# EAGLE design f103Ard (EAGLE 4.13)
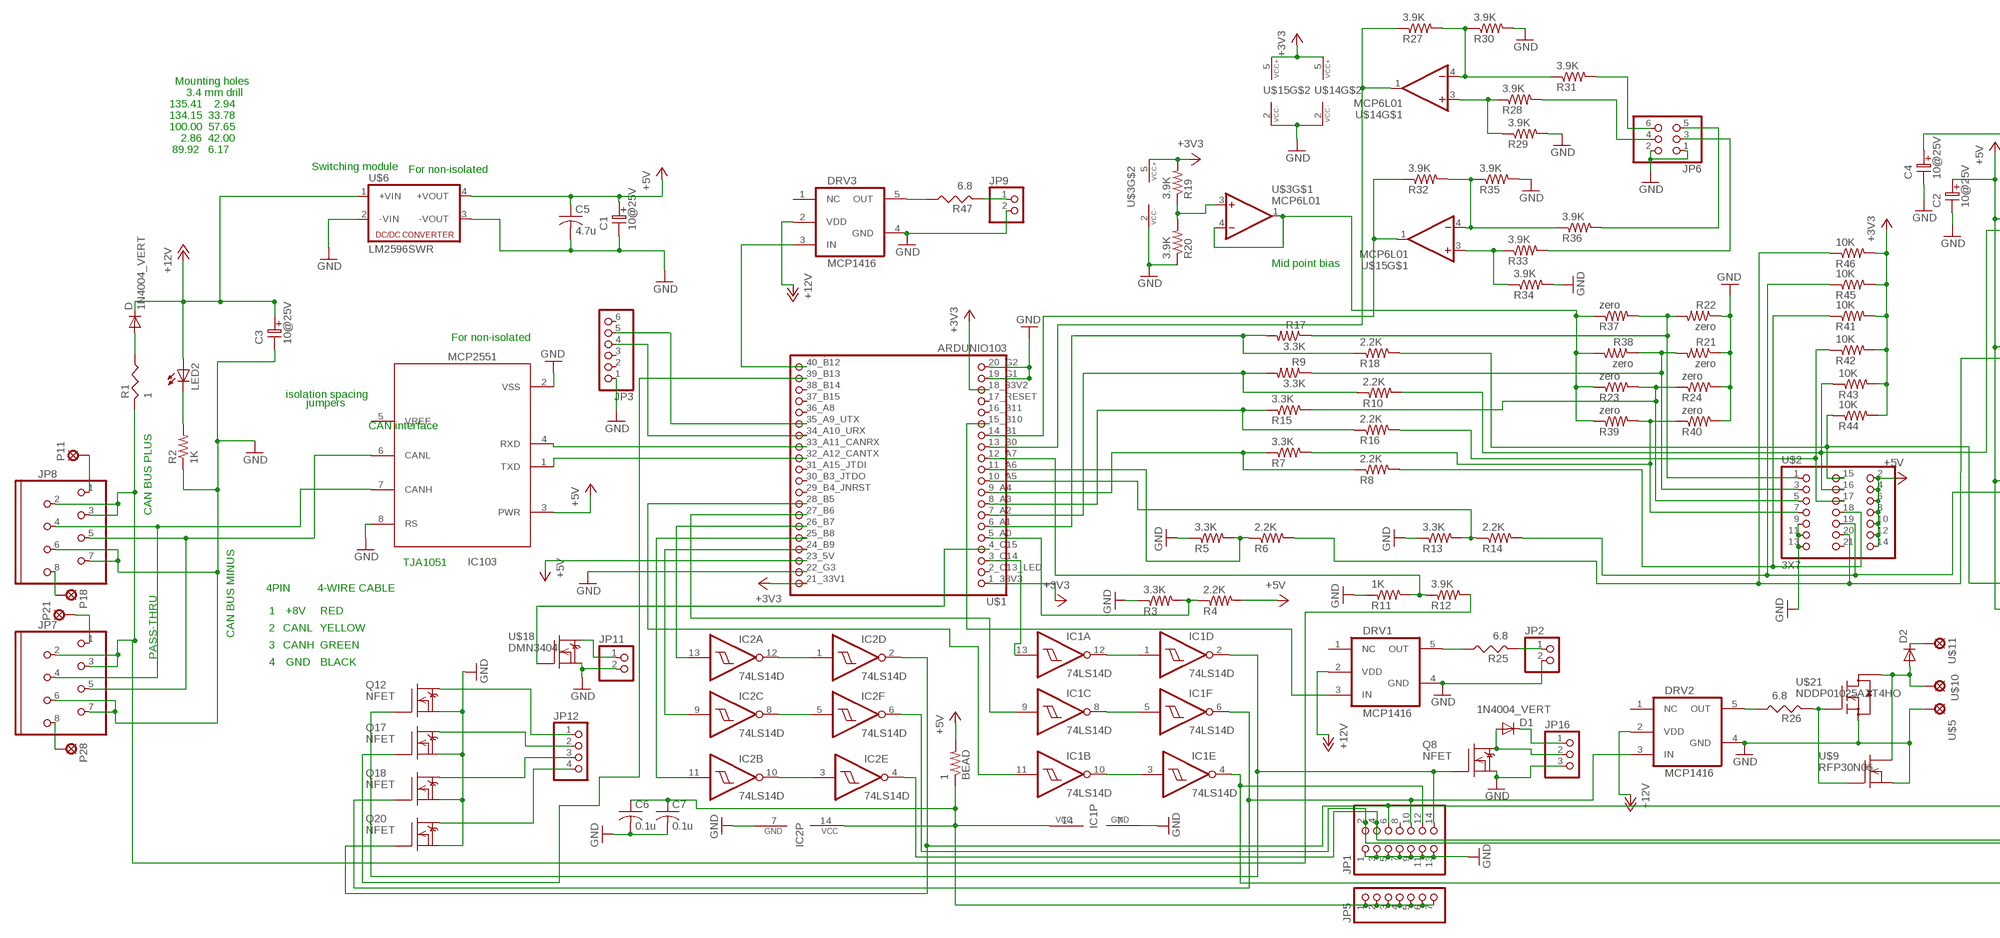
[diagram p0: schematic, sheet 1, part 1 of 2]
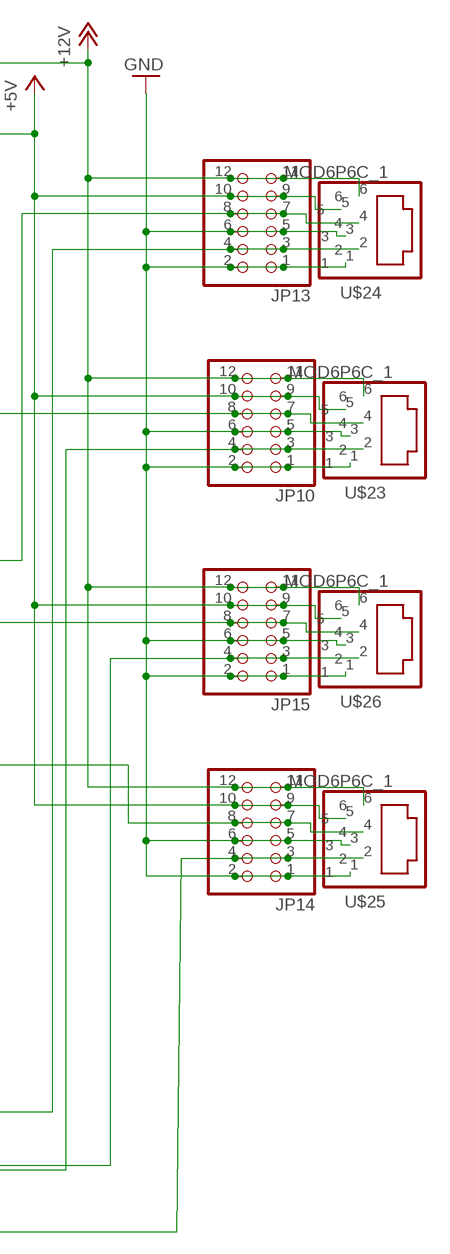
[diagram p1: schematic, sheet 1, part 2 of 2]

## Parts
BEAD  1  R-US_R0603  [R0603]
C1  10@25V  ELC-2,5L  [ES-2,5L]
C2  10@25V  ELC-2,5L  [ES-2,5L]
C3  10@25V  ELC-2,5L  [ES-2,5L]
C4  10@25V  ELC-2,5L  [ES-2,5L]
C5  4.7u  C-USC0603  [C0603]
C6  0.1u  C-USC0603  [C0603]
C7  0.1u  C-USC0603  [C0603]
D  1N4004_VERT  [DO41-10_VERT]
D1  1N4004_VERT  [DO41-10_VERT]
D2  DIODE-DO220S  [DO220S]
DRV1  MCP1416  [SOT23-5]
DRV2  MCP1416  [SOT23-5]
DRV3  MCP1416  [SOT23-5]
IC1  74LS14D  [SO14]
IC2  74LS14D  [SO14]
IC103  MCP2551  [SO-08]
JP1  PINHD-2X7  [2X07]
JP2  PINHD-1X2  [1X02]
JP3  PINHD-1X6  [1X06]
JP5  PINHD-1X7  [1X07]
JP6  PINHD-2X3  [2X03]
JP7  MOD8P8C  [MOD8P8C]
JP8  MOD8P8C  [MOD8P8C]
JP9  PINHD-1X2  [1X02]
JP10  PINHD-2X6  [2X06]
JP11  PINHD-1X2  [1X02]
JP12  PINHD-1X4  [1X04]
JP13  PINHD-2X6  [2X06]
JP14  PINHD-2X6  [2X06]
JP15  PINHD-2X6  [2X06]
JP16  PINHD-1X3  [1X03]
LED2  LEDCHIPLED_0805  [CHIPLED_0805]
P11  SOLPAD035  [SOLDPAD035]
P18  SOLPAD035  [SOLDPAD035]
P21  SOLPAD035  [SOLDPAD035]
P28  SOLPAD035  [SOLDPAD035]
Q8  NFET  DMN3404L  [SOT-23]
Q12  NFET  DMN3404L  [SOT-23]
Q17  NFET  DMN3404L  [SOT-23]
Q18  NFET  DMN3404L  [SOT-23]
Q20  NFET  DMN3404L  [SOT-23]
R1  1  RESUS-S2,5  [RS-2,5]
R2  1K  R-US_R0603  [R0603]
R3  3.3K  R-US_R0603  [R0603]
R4  2.2K  R-US_R0603  [R0603]
R5  3.3K  R-US_R0603  [R0603]
R6  2.2K  R-US_R0603  [R0603]
R7  3.3K  R-US_R0603  [R0603]
R8  2.2K  R-US_R0603  [R0603]
R9  3.3K  R-US_R0603  [R0603]
R10  2.2K  R-US_R0603  [R0603]
R11  1K  R-US_R0603  [R0603]
R12  3.9K  R-US_R0603  [R0603]
R13  3.3K  R-US_R0603  [R0603]
R14  2.2K  R-US_R0603  [R0603]
R15  3.3K  R-US_R0603  [R0603]
R16  2.2K  R-US_R0603  [R0603]
R17  3.3K  R-US_R0603  [R0603]
R18  2.2K  R-US_R0603  [R0603]
R19  3.9K  R-US_R0603  [R0603]
R20  3.9K  R-US_R0603  [R0603]
R21  zero  R-US_R0603  [R0603]
R22  zero  R-US_R0603  [R0603]
R23  zero  R-US_R0603  [R0603]
R24  zero  R-US_R0603  [R0603]
R25  6.8  RESUS-S2,5  [RS-2,5]
R26  6.8  RESUS-S2,5  [RS-2,5]
R27  3.9K  R-US_R0603  [R0603]
R28  3.9K  R-US_R0603  [R0603]
R29  3.9K  R-US_R0603  [R0603]
R30  3.9K  R-US_R0603  [R0603]
R31  3.9K  R-US_R0603  [R0603]
R32  3.9K  R-US_R0603  [R0603]
R33  3.9K  R-US_R0603  [R0603]
R34  3.9K  R-US_R0603  [R0603]
R35  3.9K  R-US_R0603  [R0603]
R36  3.9K  R-US_R0603  [R0603]
R37  zero  R-US_R0603  [R0603]
R38  zero  R-US_R0603  [R0603]
R39  zero  R-US_R0603  [R0603]
R40  zero  R-US_R0603  [R0603]
R41  10K  R-US_R0603  [R0603]
R42  10K  R-US_R0603  [R0603]
R43  10K  R-US_R0603  [R0603]
R44  10K  R-US_R0603  [R0603]
R45  10K  R-US_R0603  [R0603]
R46  10K  R-US_R0603  [R0603]
R47  6.8  RESUS-S2,5  [RS-2,5]
U$1  ARDUNIO103  [ARDUNIO103]
U$2  3X7  [3X7]
U$3  MCP6L01  [SOT23-5]
U$5  SOLPAD060  [SOLPAD060]
U$6  LM2596SWR  [LM2596SW]
U$9  RFP30N06  [TO220V]
U$10  SOLPAD060  [SOLPAD060]
U$11  SOLPAD060  [SOLPAD060]
U$14  MCP6L01  [SOT23-5]
U$15  MCP6L01  [SOT23-5]
U$18  DMN3404L  [SOT-23]
U$21  NDDP01025AZT4HO  [TO-252]
U$23  MOD6P6C_1  [MOD6P6C_1]
U$24  MOD6P6C_1  [MOD6P6C_1]
U$25  MOD6P6C_1  [MOD6P6C_1]
U$26  MOD6P6C_1  [MOD6P6C_1]

## Nets
5VISO: BEAD.1 C6.1 C7.1 IC1.14(P:VCC) IC2.14(P:VCC) JP5.1 JP5.2 JP5.3 JP5.4 JP5.5 JP5.6 JP5.7
+3V3: R19.2 R41.2 R42.2 R43.2 R44.2 R45.2 R46.2 U$1.1_33V3 U$1.18_33V2 U$1.21_33V1 U$3.5(VCC+) U$14.5(VCC+) U$15.5(VCC+)
+5V: BEAD.2 C1.1 C2.1 C5.1 IC103.3(PWR) JP10.9 JP10.10 JP13.9 JP13.10 JP14.9 JP14.10 JP15.9 JP15.10 R4.2 U$1.23_5V U$2.2 U$2.4 U$2.6 U$2.8 U$2.10 U$2.12 U$2.14 U$6.4(+VOUT) U$23.5 U$24.5 U$25.5 U$26.5
+12V: C3.1 C4.1 D.C DRV1.2(VDD) DRV2.2(VDD) DRV3.2(VDD) JP10.11 JP10.12 JP13.11 JP13.12 JP14.11 JP14.12 JP15.11 JP15.12 LED2.A U$6.1(+VIN) U$23.6 U$24.6 U$25.6 U$26.6
+12V_RESISTORED: D.A R1.1
A0: R3.2 R4.1 U$1.5_A0
A1: R17.2 R18.1 U$1.6_A1
A1BIAS: R17.1 R22.2 R37.2 U$2.1
A2: R9.2 R10.1 U$1.7_A2
A2BIAS: R9.1 R21.2 R38.1 U$2.3
A3: R15.1 R16.1 U$1.8_A3
A3BIAS: R15.2 R23.2 R24.1 U$2.5
A4: R7.1 R8.1 U$1.9_A4
A4BIAS: R7.2 R39.2 R40.1 U$2.7
A5: R13.2 R14.1 U$1.10_A5
A6: R5.2 R6.1 U$1.11_A6
A7: R11.2 R12.1 U$1.12_A7
B0: R27.1 U$1.13_B0 U$14.1(OUT)
B0_M-IN: R27.2 R30.1 R31.1 U$14.4(-IN)
B0_M_DIV: JP6.6 R31.2
B0_P_DIV: JP6.4 R28.2
B0_P_IN: R28.1 R29.1 U$14.3(+IN)
B1: R32.1 U$1.14_B1 U$15.1(OUT)
B1_M_DIV: JP6.5 R36.2
B1_M_IN: R32.2 R35.1 R36.1 U$15.4(-IN)
B1_P_DIV: JP6.3 R33.2
B1_P_M: R33.1 R34.1 U$15.3(+IN)
B5: IC1.11(B:I) U$1.28_B5
B5BUF: IC1.4(E:O) JP1.12 JP14.3 JP14.4 U$25.2
B6: IC1.9(C:I) U$1.27_B6
B6BUFF: DRV2.3(IN) IC1.6(F:O) JP1.10 Q18.1(G)
B7: IC2.13(A:I) U$1.26_B7
B7BUF: IC2.2(D:O) JP1.6 JP13.3 JP13.4 Q20.1(G) U$24.2
B8: IC2.11(B:I) U$1.25_B8
B8BUF: IC2.4(E:O) JP1.4 JP15.3 JP15.4 U$26.2
B9: IC2.9(C:I) U$1.24_B9
B9BUF: IC2.6(F:O) JP1.2 JP10.3 JP10.4 U$23.2
B10: DRV1.3(IN) U$1.15_B10
B10DRV: DRV1.5(OUT) R25.1
B10DRVOUT: JP2.1 R25.2
B12: DRV3.3(IN) U$1.40_B12
B12DRV: DRV3.5(OUT) R47.1
B12DRVOUT: JP9.1 R47.2
B13: Q17.1(G) U$1.39_B13
BF6: JP12.3 Q18.3(D)
BF7: JP12.4 Q20.3(D)
BIA_MIDPT_IN: R19.1 R20.2 U$3.3(+IN)
BIAS_MIDPT_OUT: R23.1 R37.1 R38.2 R39.1 U$3.1(OUT) U$3.4(-IN)
C14: IC1.13(A:I) U$1.3_C14
C14BUF: IC1.2(D:O) JP1.14 Q8.1(G) Q12.1(G)
C15: U$1.4_C15 U$18.1(G)
CAN_RAW_PLUS: JP7.2 JP7.3 JP8.2 JP8.3 R1.2 R12.2
CANCABLE_1_1: JP8.1 P11.MP
CANCABLE_1_8: JP8.8 P18.MP
CANCABLE_2_1: JP7.1 P21.MP
CANCABLE_2_8: JP7.8 P28.MP
CANRX: IC103.4(RXD) U$1.33_A11_CANRX
CANTX: IC103.1(TXD) U$1.32_A12_CANTX
CF14: JP12.1 Q12.3(D)
DIODE+: D2.C U$11.MP
DIV1: JP14.7 JP14.8 R18.2 R44.1 U$2.15 U$25.4
DIV2: JP13.7 JP13.8 R10.2 R43.1 U$2.16 U$24.4
DIV3: R16.2 R42.1 U$2.17
DIV4: R8.2 R41.1 U$2.18
DIV5: JP15.7 JP15.8 R14.2 R45.1 U$2.19 U$26.4
DIV6: JP10.7 JP10.8 R6.2 R46.1 U$2.20 U$23.4
FET-D: D2.A U$9.2(D) U$10.MP U$21.3(D)
GND: C1.2 C2.2 C3.2 C4.2 C5.2 C6.2 C7.2 DRV1.4(GND) DRV2.4(GND) DRV3.4(GND) IC1.7(P:GND) IC2.7(P:GND) IC103.2(VSS) IC103.8(RS) JP1.1 JP1.3 JP1.5 JP1.7 JP1.9 JP1.11 JP1.13 JP2.2 JP3.1 JP6.1 JP6.2 JP7.6 JP7.7 JP8.6 JP8.7 JP9.2 JP10.1 JP10.2 JP10.5 JP10.6 JP11.2 JP13.1 JP13.2 JP13.5 JP13.6 JP14.1 JP14.2 JP14.5 JP14.6 JP15.1 JP15.2 JP15.5 JP15.6 JP16.3 Q8.2(S) Q12.2(S) Q17.2(S) Q18.2(S) Q20.2(S) R2.1 R3.1 R5.1 R11.1 R13.1 R20.1 R21.1 R22.1 R24.2 R29.2 R30.2 R34.2 R35.2 R40.2 U$1.19_G1 U$1.20_G2 U$1.22_G3 U$2.9 U$2.11 U$2.13 U$3.2(VCC-) U$5.MP U$6.2(-VIN) U$6.3(-VOUT) U$9.3(S) U$14.2(VCC-) U$15.2(VCC-) U$18.2(S) U$21.2(S) U$23.1 U$23.3 U$24.1 U$24.3 U$25.1 U$25.3 U$26.1 U$26.3
LED_BUS_PWR: LED2.C R2.2
MCP2551_CANH: IC103.7(CANH) JP7.4 JP8.4
MCP2551_CANL: IC103.6(CANL) JP7.5 JP8.5
N$2: JP11.1 U$18.3(D)
N$5: JP12.2 Q17.3(D)
N$29: R26.2 U$9.1(G) U$21.1(G)
N$38: D1.A JP16.2 Q8.3(D)
N$39: D1.C JP16.1
N$41: DRV2.5(OUT) R26.1
NB5: IC1.3(E:I) IC1.10(B:O)
NB6: IC1.5(F:I) IC1.8(C:O)
NB7: IC2.1(D:I) IC2.12(A:O)
NB8: IC2.3(E:I) IC2.10(B:O)
NB9: IC2.5(F:I) IC2.8(C:O)
NC14: IC1.1(D:I) IC1.12(A:O)
PA9_USART1_TX: JP3.5 U$1.35_A9_UTX
PA10_USART1_RX: JP3.4 U$1.34_A10_URX
Unconnected: DRV1.1(NC) DRV2.1(NC) DRV3.1(NC) IC103.5(VREF) JP1.8 JP3.2 JP3.3 JP3.6 U$1.2_C13_LED U$1.16_B11 U$1.17_RESET U$1.29_B4_JNRST U$1.30_B3_JTDO U$1.31_A15_JTDI U$1.36_A8 U$1.37_B15 U$1.38_B14 U$2.21

## Notes on the sheet
- Mounting holes
- 3.4 mm drill
- 135.41    2.94
- 134.15  33.78
- 100.00  57.65
- 2.86  42.00
- 89.92   6.17
- Switching module | For non-isolated
- Mid point bias
- For non-isolated
- isolation spacing
- jumpers
- CAN interface
- CAN BUS PLUS
- TJA1051
- PASS-THRU | 4PIN | 4-WIRE CABLE
- 1 | +8V | RED
- 2 | CANL | YELLOW
- CAN BUS MINUS
- 3 | CANH | GREEN
- 4 | GND | BLACK

## Library data of the parts
BEAD R2-R24 R27-R46 = rcl:R-US_: RESISTOR, American symbol
C1-C4 = DEH:ELC-2,5L
C5-C7 = rcl:C-US: CAPACITOR, American symbol
D D1 = diode:1N4004_VERT
D2 = diode-1:DIODE-: DIODE
DRV1-DRV3 = DEH:MCP1416
IC1 IC2 = 74xx-us:74*14: Hex schmitt trigger INVERTER
IC103 = texas:MCP2551
JP1 = pinhead:PINHD-2X7: PIN HEADER
JP2 JP9 JP11 = pinhead:PINHD-1X2: PIN HEADER
JP3 = pinhead:PINHD-1X6: PIN HEADER
JP5 = pinhead:PINHD-1X7: PIN HEADER
JP6 = pinhead:PINHD-2X3: PIN HEADER
JP7 JP8 = DEH:MOD8P8C
JP10 JP13-JP15 = pinhead:PINHD-2X6: PIN HEADER
JP12 = pinhead:PINHD-1X4: PIN HEADER
JP16 = pinhead:PINHD-1X3: PIN HEADER
LED2 = led:LED: LED OSRAM: - CHIPLED LG R971, LG N971, LY N971, LG Q971, LY Q971, LO R971, LY R971 LH N974, LH R974 LS Q976, LO Q976, LY Q976 LO Q996 - Hyper CHIPLED LW Q18S LB Q993, LB Q99A, LB R99A - SideLED LS A670, LO A670, LY A670, LG A670, LP A670 LB A673, LV A673, LT A673, LW A673 LH A674 LY A675 LS A676, LA A676, LO A676, LY A676, LW A676 LS A679, LY A679, LG A679 - Hyper Micro SIDELED® LS Y876, LA Y876, LO Y876, LY Y876 LT Y87S - SmartLED LW L88C, LW L88S LB L89C, LB L89S, LG L890 LS L89K, LO L89K, LY L89K LS L896, LA L896, LO L896, LY L896 - TOPLED LS T670, LO T670, LY T670, LG T670, LP T670 LSG T670, LSP T670, LSY T670, LOP T670, LYG T670 LG T671, LOG T671, LSG T671 LB T673, LV T673, LT T673, LW T673 LH T674 LS T676, LA T676, LO T676, LY T676, LB T676, LH T676, LSB T676, LW T676 LB T67C, LV T67C, LT T67C, LS T67K, LO T67K, LY T67K, LW E67C LS E67B, LA E67B, LO E67B, LY E67B, LB E67C, LV E67C, LT E67C LW T67C LS T679, LY T679, LG T679 LS T770, LO T770, LY T770, LG T770, LP T770 LB T773, LV T773, LT T773, LW T773 LH T774 LS E675, LA E675, LY E675, LS T675 LS T776, LA T776, LO T776, LY T776, LB T776 LHGB T686 LT T68C, LB T68C - Hyper Mini TOPLED® LB M676 - Mini TOPLED Santana® LG M470 LS M47K, LO M47K, LY M47K Source: http://www.osram.convergy.de/
P11 P18 P21 P28 = solpad:SOLPAD035
Q8 Q12 Q17 Q18 Q20 U$18 = transistor-fet:DMN3404L
R1 R25 R26 R47 = DEH:RESUS-S2,5
U$1 = pinhead:ARDUNIO103
U$2 = pinhead:3X7
U$3 U$14 U$15 = op-amp:MCP6L01
U$5 U$10 U$11 = solpad:SOLPAD060
U$6 = dc-dc-converter:LM2596SWR
U$9 = transistor-fet:RFP30N06
U$21 = transistor-fet:NDDP01025AZT4HO
U$23-U$26 = DEH:MOD6P6C_1

## Board
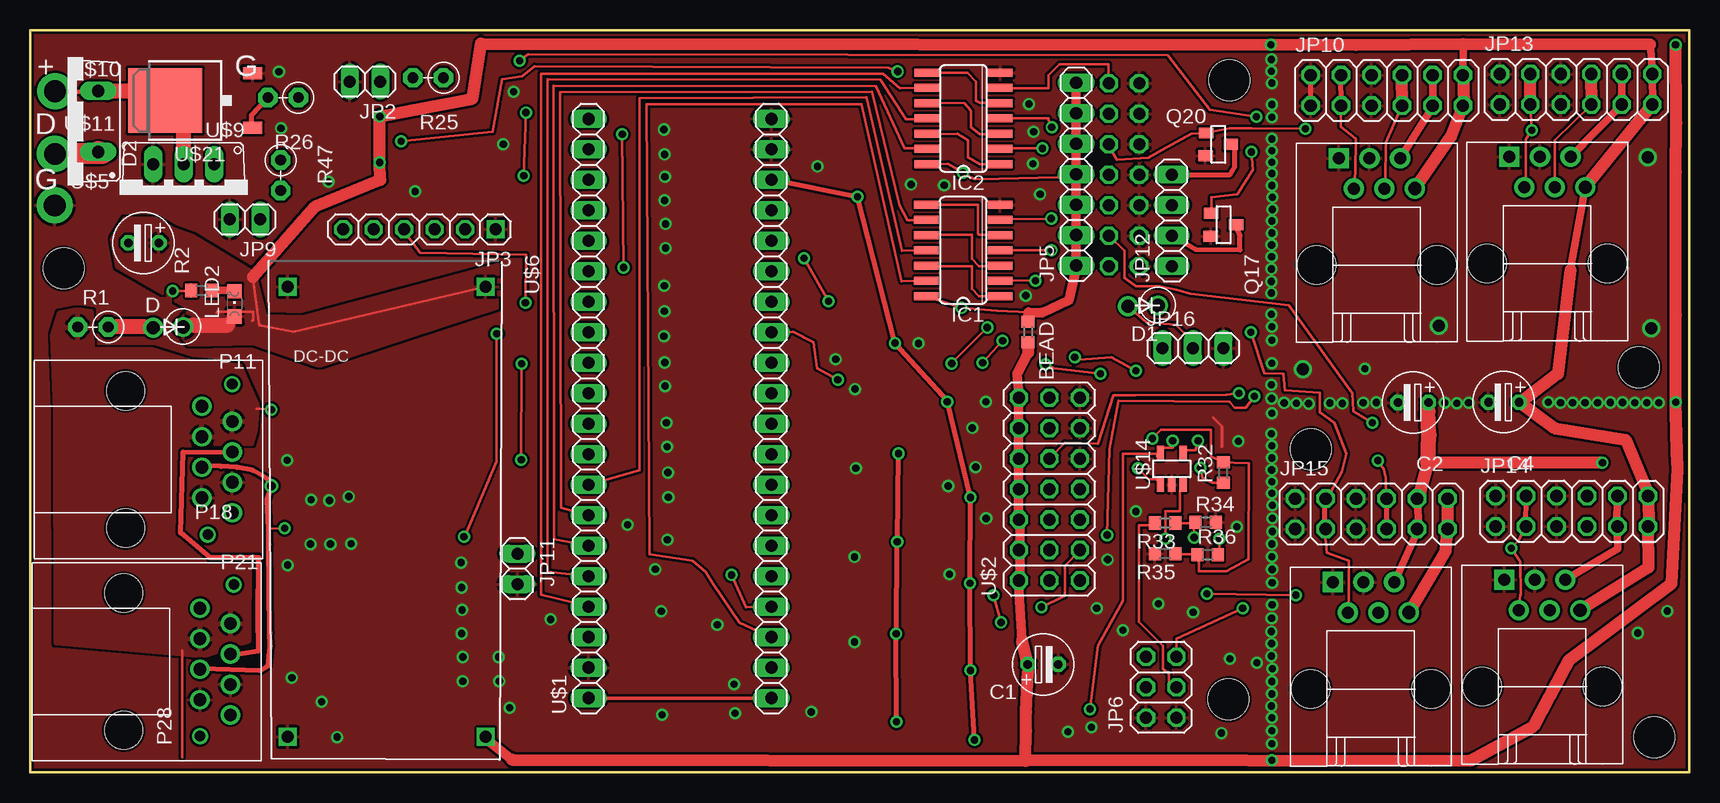
[diagram p2: board, top side]
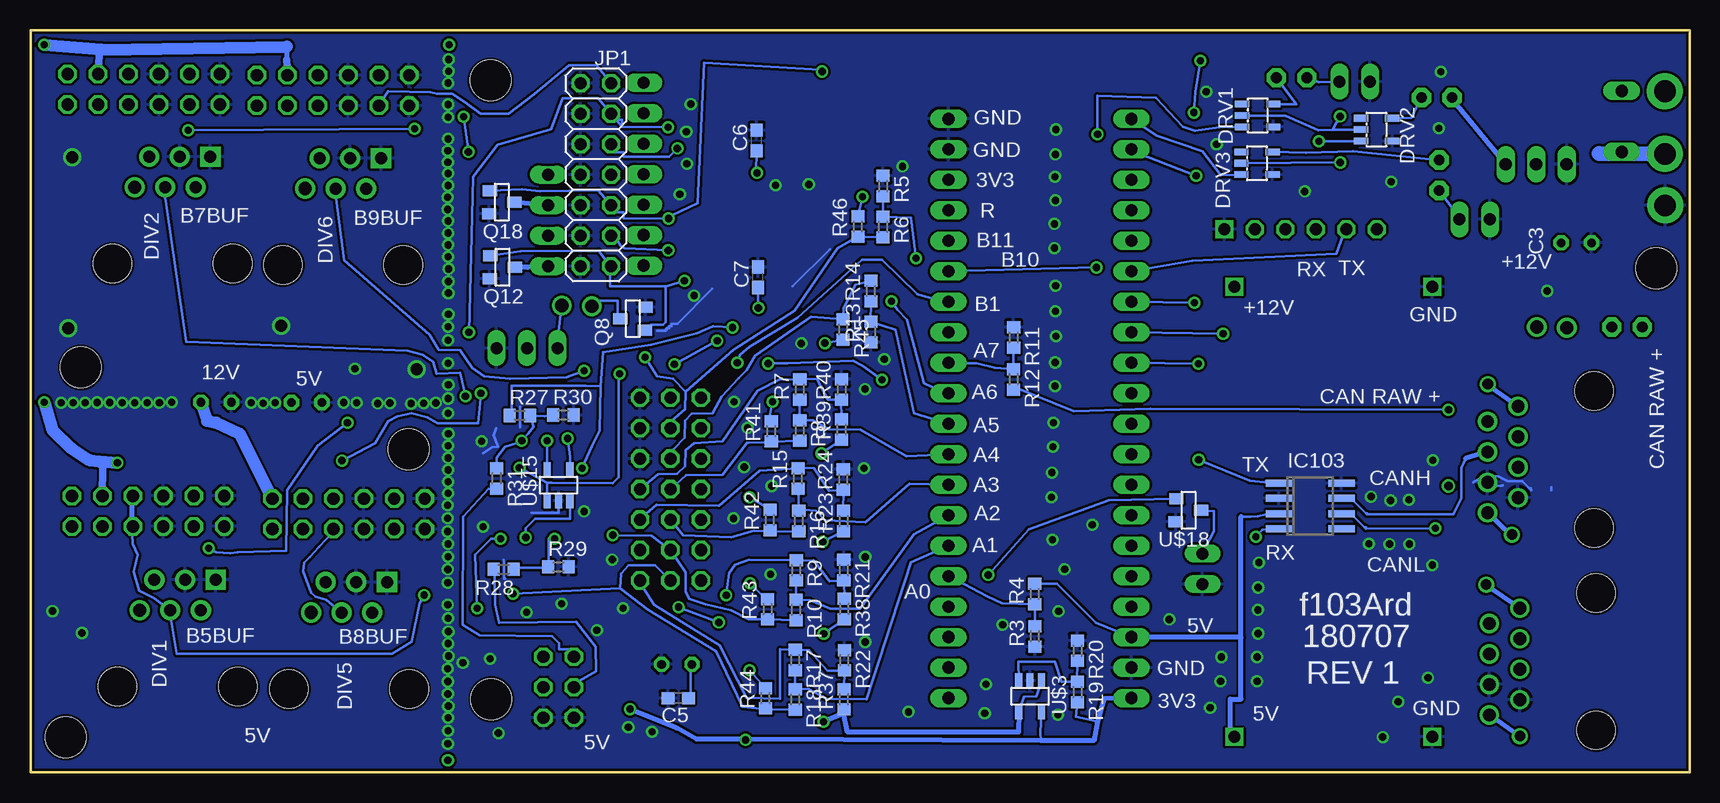
[diagram p3: board, bottom side, seen from below]

Size 138.32 x 61.85 mm. Coordinates in mm from the lower left corner, seen from the top.
Outline: 0,0 0,61.85 138.32,61.85 138.32,0 0,0
Copper layers (1*16): Top 0.035mm / dielectric 1.5mm / Bottom 0.035mm
Design rules "default": minimum track width 8mil, minimum drill 0.6mm, track to track 8mil, track to pad 8mil, pad to pad 10mil, via to via 8mil, smd to smd 0mil, copper to edge 8mil, drill to drill 8mil, minimum pad ring 8mil, minimum via ring 8mil, stop-mask expansion 4mil, vias tented up to drill 0mil, thermal gap 10mil
Holes 3.4 mm at 99.97,57.65 106.79,26.92 99.91,6.08 135.39,2.91 2.8,41.98 134.12,33.73

### Footprints (pad centres in the part's own frame; a part is rotated, then mirrored left to right if it is on the bottom)
R0603 = smd 1 x 1.1: 1 -0.85,0; 2 0.85,0
ES-2,5L = drill 0.711 pad 1.27 octagon: 1 0,0; 2 2.54,0
C0603 = smd 1.1 x 1: 1 -0.85,0; 2 0.85,0
DO41-10_VERT = drill 1.1 round: A 2.58,0.05; C 0.07,0
DO220S = drill 1.016 long: A 2.54,-2.54; C -2.54,-2.54
SOT23-5 = smd 0.55 x 1.2: 1 -0.95,-1.3; 2 0,-1.3; 3 0.95,-1.3; 4 0.95,1.3; 5 -0.95,1.3
SO14 = smd 0.66 x 2.032: 1 -3.81,-3.073; 2 -2.54,-3.073; 3 -1.27,-3.073; 4 0,-3.073; 5 1.27,-3.073; 6 2.54,-3.073; 7 3.81,-3.073; 8 3.81,3.073; 9 2.54,3.073; 10 1.27,3.073; 11 0,3.073; 12 -1.27,3.073; 13 -2.54,3.073; 14 -3.81,3.073
SO-08 = smd 0.6 x 2.2: 1 -1.905,-2.6; 2 -0.635,-2.6; 3 0.635,-2.6; 4 1.905,-2.6; 5 1.905,2.6; 6 0.635,2.6; 7 -0.635,2.6; 8 -1.905,2.6
2X07 = drill 1.016 octagon: 1 -7.62,-1.27; 2 -7.62,1.27; 3 -5.08,-1.27; 4 -5.08,1.27; 5 -2.54,-1.27; 6 -2.54,1.27; 7 0,-1.27; 8 0,1.27; 9 2.54,-1.27; 10 2.54,1.27; 11 5.08,-1.27; 12 5.08,1.27; 13 7.62,-1.27; 14 7.62,1.27
1X02 = drill 1 long: 1 -1.27,0; 2 1.27,0
1X06 = drill 1 square: 1 -6.35,0 | drill 1 octagon: 2 -3.81,0; 3 -1.27,0; 4 1.27,0; 5 3.81,0; 6 6.35,0
1X07 = drill 1.016 long: 1 -7.62,0; 2 -5.08,0; 3 -2.54,0; 4 0,0; 5 2.54,0; 6 5.08,0; 7 7.62,0
2X03 = drill 1.016 octagon: 1 -2.54,-1.27; 2 -2.54,1.27; 3 0,-1.27; 4 0,1.27; 5 2.54,-1.27; 6 2.54,1.27
MOD8P8C = drill 1.067 pad 1.397 round: 1 -3.81,-2.54; 2 -2.54,0; 3 -1.27,-2.54; 4 0,0; 5 1.27,-2.54; 6 2.54,0; 7 3.81,-2.54; 8 5.08,0 | hole 3.175: -5.08,-8.89; 6.35,-8.89
2X06 = drill 1.016 octagon: 1 -6.35,-1.27; 2 -6.35,1.27; 3 -3.81,-1.27; 4 -3.81,1.27; 5 -1.27,-1.27; 6 -1.27,1.27; 7 1.27,-1.27; 8 1.27,1.27; 9 3.81,-1.27; 10 3.81,1.27; 11 6.35,-1.27; 12 6.35,1.27
1X04 = drill 1 long: 1 -3.81,0; 2 -1.27,0; 3 1.27,0; 4 3.81,0
1X03 = drill 1 long: 1 -2.54,0; 2 0,0; 3 2.54,0
CHIPLED_0805 = smd 1.2 x 1.2: A 0,-1.05; C 0,1.05
SOLDPAD035 = drill 0.889 pad 1.27 round: MP 0,0
SOT-23 = smd 0.9 x 1.2: 1 -1,-1.006; 2 0.9,-1.056; 3 -0.05,1.056
RS-2,5 = drill 0.9 pad 1.6 octagon: 1 0,0; 2 2.54,0
ARDUNIO103 = drill 1.016 long: 1_33V3 -21.59,-7.62; 2_C13_LED -19.05,-7.62; 3_C14 -16.51,-7.62; 4_C15 -13.97,-7.62; 5_A0 -11.43,-7.62; 6_A1 -8.89,-7.62; 7_A2 -6.35,-7.62; 8_A3 -3.81,-7.62; 9_A4 -1.27,-7.62; 10_A5 1.27,-7.62; 11_A6 3.81,-7.62; 12_A7 6.35,-7.62; 13_B0 8.89,-7.62; 14_B1 11.43,-7.62; 15_B10 13.97,-7.62; 16_B11 16.51,-7.62; 17_RESET 19.05,-7.62; 18_33V2 21.59,-7.62; 19_G1 24.13,-7.62; 20_G2 26.67,-7.62; 21_33V1 -21.59,7.62; 22_G3 -19.05,7.62; 23_5V -16.51,7.62; 24_B9 -13.97,7.62; 25_B8 -11.43,7.62; 26_B7 -8.89,7.62; 27_B6 -6.35,7.62; 28_B5 -3.81,7.62; 29_B4_JNRST -1.27,7.62; 30_B3_JTDO 1.27,7.62; 31_A15_JTDI 3.81,7.62; 32_A12_CANTX 6.35,7.62; 33_A11_CANRX 8.89,7.62; 34_A10_URX 11.43,7.62; 35_A9_UTX 13.97,7.62; 36_A8 16.51,7.62; 37_B15 19.05,7.62; 38_B14 21.59,7.62; 39_B13 24.13,7.62; 40_B12 26.67,7.62
3X7 = drill 1.016 octagon: 1 0,1.27; 2 0,6.35; 3 2.54,1.27; 4 2.54,6.35; 5 5.08,1.27; 6 5.08,6.35; 7 7.62,1.27; 8 7.62,6.35; 9 10.16,1.27; 10 10.16,6.35; 11 12.7,1.27; 12 12.7,6.35; 13 15.24,1.27; 14 15.24,6.35; 15 0,3.81; 16 2.54,3.81; 17 5.08,3.81; 18 7.62,3.81; 19 10.16,3.81; 20 12.7,3.81; 21 15.24,3.81
SOT23-5' = smd 0.6 x 1.2: 1 -0.95,-1.306; 2 0,-1.306; 3 0.95,-1.306; 4 0.95,1.306; 5 -0.95,1.306
SOLPAD060 = drill 1.8 pad 3 round: MP 0,0
LM2596SW = drill 1 square: 1 0,16.5; 2 0,0; 3 37.5,0; 4 37.5,16.5
TO220V = drill 1.016 long: 1 -2.54,-2.54; 2 0,-2.54; 3 2.54,-2.54
TO-252 = smd 1 x 1.6: 1 -2.28,-7.34; 2 2.28,-7.34 | smd 5.4 x 6.2: 3 0,-0.04
MOD6P6C_1 = drill 1 pad 1.676 square: 1 -3.175,8.898 | drill 1 pad 1.676 round: 2 -1.951,6.358; 3 -0.627,8.898; 4 0.597,6.358; 5 1.921,8.898 | drill 1.1 pad 1.676 round: 6 3.145,6.358 | hole 3.2: -5.029,-0.01; 4.999,-0.01

### Placement (x,y rotation side)
BEAD  83.19,36.68 270 top
C1  83.18,8.99 0 top
C2  116.57,30.8 180 top
C3  10.74,44.11 180 top
C4  124.12,30.83 180 top
C5  84.33,6.17 180 bottom
C6  77.8,52.64 90 bottom
C7  77.68,41.25 90 bottom
D  12.84,37.1 180 top
D1  94.11,38.89 180 top
D2  3.15,54.23 90 top
DRV1  36.02,54.73 270 bottom
DRV2  26.12,53.55 270 bottom
DRV3  36.09,50.75 270 bottom
IC1  77.79,43.49 90 top
IC2  77.81,54.48 90 top
IC103  31.64,22.18 270 bottom
JP1  91.2,49.79 270 bottom
JP2  27.93,57.55 180 top
JP3  32.46,45.24 180 top
JP5  87.21,49.84 90 top
JP6  94.3,7.08 90 top
JP7  16.71,9.85 270 top
JP8  16.87,26.69 270 top
JP9  17.93,46.06 180 top
JP10  113.1,56.82 0 top
JP11  40.63,16.94 270 top
JP12  95.18,45.99 90 top
JP13  128.88,56.91 0 top
JP14  128.52,21.75 0 top
JP15  111.81,21.53 0 top
JP16  96.94,35.34 0 top
LED2  17.05,39.03 0 top
P11  16.85,32.34 0 top
P18  14.83,19.8 0 top
P21  16.99,15.63 0 top
P28  14.17,3.01 0 top
Q8  88.11,37.84 90 bottom
Q12  98.99,42.03 270 bottom
Q17  99.48,45.57 270 top
Q18  99.04,47.45 270 bottom
Q20  99.05,52.27 270 top
R1  6.51,37.1 180 top
R2  14.3,40.14 0 top
R3  54.6,11.32 90 bottom
R4  54.62,14.85 90 bottom
R5  67.25,48.84 270 bottom
R6  67.26,45.44 270 bottom
R7  74.2,31.89 90 bottom
R8  74.2,28.47 270 bottom
R9  74.49,16.83 270 bottom
R10  74.51,13.53 270 bottom
R11  56.37,36.23 270 bottom
R12  56.38,32.74 270 bottom
R13  68.26,36.68 90 bottom
R14  68.27,40.1 90 bottom
R15  74.35,24.48 90 bottom
R16  74.29,20.95 270 bottom
R17  74.58,9.35 270 bottom
R18  74.58,6.06 270 bottom
R19  51.05,6.67 270 bottom
R20  51.05,10.12 270 bottom
R21  70.53,16.84 270 bottom
R22  70.48,9.33 270 bottom
R23  70.55,20.92 90 bottom
R24  70.57,24.39 90 bottom
R25  34.46,57.87 180 top
R26  22.37,56.22 180 top
R27  97.53,29.73 0 bottom
R28  98.89,16.91 180 bottom
R29  94.31,17.11 0 bottom
R30  93.91,29.76 0 bottom
R31  99.47,24.49 270 bottom
R32  99.47,24.96 90 top
R33  94.64,20.77 180 top
R34  98.01,20.83 0 top
R35  94.61,18.21 180 top
R36  98.17,18.12 0 top
R37  70.52,6.08 90 bottom
R38  70.49,13.61 270 bottom
R39  70.72,28.56 90 bottom
R40  70.71,31.89 90 bottom
R41  76.58,28.41 90 bottom
R42  76.69,21.02 90 bottom
R43  76.88,13.58 90 bottom
R44  77.06,6.16 90 bottom
R45  70.59,36.89 270 bottom
R46  69.35,45.47 90 bottom
R47  20.9,51.01 270 top
U$1  54.18,27.77 90 top
U$2  88.79,15.97 90 top
U$3  MCP6L01  [SOT23-5']  55,6.33 180 bottom
U$5  2.06,47.23 0 top
U$6  21.48,40.44 270 top
U$9  12.82,48.12 180 top
U$10  2.09,56.75 0 top
U$11  2.08,51.53 0 top
U$14  MCP6L01  [SOT23-5']  95.17,25.28 0 top
U$15  MCP6L01  [SOT23-5']  94.31,23.92 0 bottom
U$18  41.8,21.78 270 bottom
U$21  11.23,55.97 90 top
U$23  112.29,42.28 0 top
U$24  126.5,42.39 0 top
U$25  126.07,7.14 0 top
U$26  111.79,6.95 0 top

### Tracks (layer width: path | path; a pad name or v marks a point on that pad's centre or on a via)
5VISO  (via drill 0.6)
  Top 0.203: 78.64,49.47 76.53,50.69 IC2.14 | 78.64,49.47 79.13,49.43 85.7,49.58 JP5.4 | 78.64,49.47 v77.77,49.94 | IC1.14 v77.65,38.69 80.62,38.46 83.25,38.31
  Top 0.8: JP5.7 87.2,56.78 87.2,55.68 JP5.6 87.2,54.18 87.2,53.08 JP5.5 87.2,51.68 87.2,50.58 JP5.4 87.2,49.08 87.2,47.98 JP5.3 87.2,46.58 87.2,45.48 JP5.2 87.2,44.08 87.2,42.98 JP5.1 87.19,41.87 86.6,39.31 84.38,38.29
  Top 0.813: 84.38,38.29 83.25,38.31 83.2,38.31 83.21,37.54 BEAD.1
  Bottom 0.203: C6.1 77.85,49.97 77.86,49.95 v77.77,49.94 | v77.65,38.69 77.66,39.72 77.7,40.38 C7.1
+3V3  (via drill 0.6)
  Top 0.203: v95.25,27.63 95.25,27.03 94.45,27.03 U$14.5 | v88.35,5.26 89,10.52 91.1,14.3 91.12,26.54 93.95,26.53 U$14.5 | U$14.5 93.95,26.33 | v76.46,30.87 76.54,30.91 | v68.97,47.96 69.05,47.92
  Top 0.305: U$1.21_33V1 46.61,6.18 | 46.61,6.18 U$1.1_33V3 | 46.61,6.18 46.61,6.1
  Top 0.406: v78.72,2.69 v78.39,8.48 v78.35,15.75 v78.39,22.9 v76.46,30.87 | 76.54,30.91 v72.11,35.76 v68.97,47.96 | 69.05,47.92 U$1.18_33V2
  Bottom 0.203: v95.25,27.63 95.25,26.33 U$15.5 | 84.49,3.69 84.5,3.69 | 54.1,2.64 54.12,3.28 U$3.5 | R19.2 51.16,4.61 49.45,4.23 49.4,4.21 | v78.39,8.48 R44.2 | 78.8,2.73 v78.72,2.69 | R43.2 76.95,14.36 v78.35,15.75 | R42.2 76.83,22 v78.39,22.9 | R41.2 76.75,29.43 v76.46,30.87 | v72.11,35.76 R45.2 | v68.97,47.96 R46.2
  Bottom 0.406: 84.5,3.69 v88.35,5.26 | U$1.21_33V1 48.84,6.11 49.4,4.21 49.68,2.64 54.1,2.64 78.8,2.73 82.81,2.75 84.49,3.69
+5V  (via drill 0.6)
  Top 0.203: 83.2,8.38 C1.1 | 116.53,30.06 C2.1 | 120.05,0.97 120.07,0.98 v103.53,0.99
  Top 0.4: U$6.4 37.97,2.78 | 82.5,16.68 U$2.2 82.4,15.7 | 82.5,17.78 U$2.4 82.5,19.18 | 82.4,21.78 U$2.6 82.5,20.38 | U$2.10 82.4,26.88 | 82.4,27.98 U$2.12 82.4,29.38 | 82.4,30.48 U$2.14 82.4,31.88
  Top 0.406: JP13.9 132.83,55.75 132.73,55.64 | JP10.9 117.1,55.74 | 115.76,20.31 JP15.9 | 115.6,22.43 JP15.10 115.66,22.72 | JP13.10 132.66,58.44 | JP10.10 116.96,58.3 | 132.28,20.54 JP14.9 | JP14.10 132.31,23.12
  Top 0.61: U$25.5 132.35,18.62 132.28,20.54 132.31,23.12 | 132.83,55.75 U$24.5 | 117.1,55.74 U$23.5 | U$26.5 115.76,20.31 115.66,22.72 | 132.66,58.44 132.73,55.64 | 116.96,58.3 JP10.9
  Top 0.8: 37.97,2.78 40.18,1.04 | 82.5,16.68 82.5,17.78 | 82.4,21.78 82.4,22.88 U$2.8 82.4,24.28 82.4,25.38 U$2.10 | 82.5,19.18 82.5,20.38 | 82.4,26.88 82.4,27.98 | 82.4,29.38 82.4,30.48 | 82.4,31.88 82.29,33.18 | 82.7,11 82.4,15.7
  Top 0.813: 82.29,33.18 83.21,34.99
  Top 1.016: 40.18,1.04 82.98,0.95 82.99,1.02 | 83.2,8.38 83.04,5 83.04,3.45 82.99,1.02 | C1.1 82.7,11 | 115.6,22.43 116.52,25.8 v131.08,25.8 | v137.17,60.61 137.24,54.1 137.2,50.02 137.2,38.09 137.18,30 137.26,26.68 137.27,26.67 137.35,25.26 | 83.21,34.99 BEAD.2 | 82.99,1.02 120.05,0.97 125.34,3.84 128.32,9.38 136.85,15.73 137.35,25.26 | 137.35,25.26 v137.18,30.82
  Top 1.27: 116.52,25.8 116.62,28.12 116.53,30.06
  Bottom 0.203: IC103.3 35.32,21.5 36.01,21.34 36.62,21.3 37.42,21.3 37.52,21.3 | 83.3,8.38 83.3,6.62 C5.1 | 83.3,8.38 83.3,8.42 | C1.1 83.3,8.38 | U$1.23_5V 49.5,12.44 52.77,15.72 R4.2 54.79,15.7
  Bottom 0.4: U$6.4 38.32,3.6 38.32,6.1 37.42,6.1 37.42,11.23 37.42,21.3
  Bottom 0.406: 37.42,11.23 37.46,11.23 U$1.23_5V | 116.96,60.46 116.98,59.37 | 132.66,58.35 JP13.10 | 132.6,59.74 132.5,60.22 | 116.88,58.19 JP10.10 | 133.42,26.01 132.31,25.41
  Bottom 0.61: 132.66,58.35 132.6,59.74 132.41,60.24 | 116.98,59.37 116.88,58.19 | 132.31,25.41 JP14.10
  Bottom 1.016: v131.08,25.8 133.42,26.01 134.88,26.97 136.51,28.52 v137.18,30.82 | 132.5,60.22 116.96,60.46 | v137.17,60.61 132.41,60.24
+12V  (via drill 0.6)
  Top 0.203: D.C 12.7,36.81 | 15.58,38.28 15.6,38.38 18.6,38.38 18.6,37.68 18.53,37.64 | U$6.1 21.99,36.7 19.12,37.24 18.58,41.26 | 29.14,50.81 29.1,50.81 v29.15,50.81 | 119.38,58.38 JP10.12 | 110.56,60.62 110.57,60.65 v103.44,60.61
  Top 0.4: U$6.1 37.94,40.4
  Top 0.406: v29.16,54.65 29.23,54.68 | 119.46,60.69 119.63,60.7 | 135.27,55.58 JP13.11 | 129.56,48.65 U$24.6 | 134.96,23.01 JP14.12 | 134.96,20.33 JP14.11 | 119.51,55.82 JP10.11 | 115.41,48.59 U$23.6 | JP15.11 118.12,20.27 | JP15.12 118.15,22.9
  Top 0.61: 135.05,60.65 135.21,58.74 135.24,58.14 JP13.12 135.27,55.58 | U$24.6 128.4,41.86 | 119.46,60.69 119.5,60.55 119.38,58.38
  Top 0.813: D.C 13.57,37.26
  Top 1.016: 18.58,41.26 23.78,47.15 29.19,49.36 29.14,50.81 v29.16,54.65 | 29.23,54.68 31.8,55.16 36.89,56.13 37.6,60.72 110.56,60.62 119.46,60.69 135.05,60.65 | JP13.11 129.56,48.65 | 134.96,23.01 133,27.69 127.09,28.68 124.2,30.83 C4.1 124.14,30.73 127.36,33.2 128.4,41.86 | JP14.12 134.96,20.33 | JP14.11 134.91,17.05 129.35,13.6 U$25.6 | JP10.12 119.51,55.82 | JP10.11 118.44,52.99 115.41,48.59 | U$26.6 117.99,18.42 118.12,20.27 | 118.15,22.9 JP15.11
  Top 1.27: 13.57,37.26 16.47,37.26
  Bottom 0.203: 29.76,53.52 DRV2.2 | 29.76,53.52 30.97,53.5 33.71,54.71 37.38,54.71 DRV1.2 | 29.76,53.52 29.76,53.57 v29.16,54.65 | v29.15,50.81 DRV3.2
  Bottom 1.016: JP15.12 120.91,28.24 122.82,29.14 123.61,29.27 C4.1
  pour Top: 13.34,38.57 12.28,37.58 12.32,36.6 13.27,35.57 18.63,35.69 24.11,33.84 38.98,38.71 39.06,42.33 22.76,37.94 19.65,38.05 18.75,41.59 13.61,44.7 11.96,45.3 10.48,46.18 7.87,46.18 6.78,44.43 7.17,42.11
+12V_RESISTORED
  Top 1.016: R1.1 7.27,37.16 | 9.47,37.16 D.A
  Top 1.27: 7.27,37.16 9.47,37.16
A0
  Bottom 0.203: R3.2 54.57,12.11 R4.1 57.35,14.1 58.6,14.65 61.74,16.34 U$1.5_A0
A1
  Bottom 0.203: R17.2 74.6,7.02 R18.1 74.61,6.89 73.52,6.94 71.97,6.13 68.62,6.06 64.92,17.48 U$1.6_A1
A1BIAS
  Bottom 0.203: R37.2 70.51,6.91 R22.2 70.51,8.44 71.87,8.46 73.41,10.17 R17.1 75.84,10.23 75.86,6.13 78.62,6.19 80.88,10.57 86.34,13.94 87.58,15.92 U$2.1
A2
  Bottom 0.203: R9.2 74.56,14.49 R10.1 74.56,14.39 73.34,14.35 71.63,13.63 69.17,13.61 64.68,19.84 U$1.7_A2
A2BIAS  (via drill 0.6)
  Top 0.203: U$2.3 86.29,17.21 86.29,14.71 v84.3,13.76 | v80.33,14.74 v80.95,12.48
  Bottom 0.203: R38.1 70.47,14.42 R21.2 71.71,15.9 73.06,17.66 74.53,17.64 R9.1 78.42,17.72 79.6,17.29 80.1,16.57 v80.33,14.74 | v80.95,12.48 v84.3,13.76
A3
  Bottom 0.203: R15.1 74.31,23.6 R16.1 74.34,21.9 72.83,21.8 72.08,21.01 68.74,20.85 65.07,24.03 U$1.8_A3
A3BIAS
  Bottom 0.203: R23.2 70.6,21.7 R24.1 71.75,23.47 73.03,25.34 74.37,25.37 R15.2 77.56,25.12 80.92,22.22 86.15,22.27 87.61,21.02 U$2.5
A4
  Bottom 0.203: R7.1 74.22,29.39 R8.1 74.23,29.34 73.1,29.32 71.79,28.56 69.15,28.54 65.32,26.32 U$1.9_A4
A4BIAS
  Bottom 0.203: R39.2 70.78,31.07 R40.1 71.86,31.04 72.76,32.73 74.22,32.78 R7.2 74.23,32.72 75.83,32.74 77.73,31.79 80.63,27.56 83.01,27.42 83.7,26.81 83.78,25.5 84.43,24.89 86.01,24.85 U$2.7
A5
  Bottom 0.203: R14.1 68.3,37.41 R13.2 68.29,37.52 66.23,36.86 64.69,29.92 U$1.10_A5
A6  (via drill 0.6)
  Top 0.203: v66.56,39.24 v64.52,42.84
  Bottom 0.203: v64.52,42.84 64.92,46.21 R6.1 67.28,46.25 R5.2 | v66.56,39.24 66.07,38.52 65.27,37.71 63.83,32.41 61.97,31.53 U$1.11_A6
A7
  Bottom 0.203: R11.2 56.4,33.62 R12.1 57.92,33.69 59.49,34.1 61.87,34.1 U$1.12_A7
B0  (via drill 0.6)
  Top 0.203: v92.35,25.33 93.25,24.43 93.95,24.43 U$14.1 | U$1.13_B0 63.61,36.69 65.31,35.85 65.62,33.68 v67.34,32.7 | v76.83,34.06 v79.8,37.06
  Bottom 0.203: R27.1 98.23,30.21 98.2,32.21 92.07,32.2 90.81,32.17 | 90.81,32.17 90.88,28.44 91.52,27.22 92.15,25.83 v92.35,25.33 | 90.81,32.17 90.61,35.01 86.58,35.63 82.76,36.59 81.44,37.15 v79.8,37.06 | v67.34,32.7 68.95,33.88 69.75,34.29 75.2,34.09 v76.83,34.06
B0_M-IN  (via drill 0.6)
  Top 0.203: v97.37,27.63 97.15,26.83 96.35,26.83 U$14.4
  Bottom 0.203: 97.15,27.63 97.33,27.72 96.83,28.21 96.37,28.79 R27.2 96.23,29.71 95.45,29.68 R30.1 | 97.15,27.63 98.75,27.11 99.48,26.21 R31.1 | v97.37,27.63 97.15,27.63
B0_M_DIV
  Bottom 0.203: R31.2 99.77,23.6 100.15,23.63 102.27,21.29 102.32,12.3 100.88,11.42 94.85,11.33 94.25,10.73 94.25,10.23 93.45,10.23 JP6.6
B0_P_DIV
  Bottom 0.203: R28.2 99.65,16.43 99.6,13.96 99.26,12.45 92.85,12.55 91.21,10.45 91.17,8.4 92.55,7.63 JP6.4
B0_P_IN  (via drill 0.6)
  Top 0.203: U$14.3 95.85,23.43 95.84,21.76 94.64,21.76 v94.64,19.46 v94.64,19.45
  Bottom 0.203: R28.1 97.55,17.03 95.65,17.03 R29.1 95.15,17.63 95.14,19.45 v94.64,19.46
B1  (via drill 0.6)
  Top 0.203: v97.57,25.36 97.73,24.53 98.55,24.11 R32.1 | v84.65,33.99 85.37,33.66 v89.22,33.2 | v79.41,34.11 v81.08,35.95
  Bottom 0.203: 95.25,24.11 v97.57,25.36 | v89.22,33.2 89.3,32.98 89.3,24.58 89.8,24.08 94.9,24.13 95.26,24.11 95.25,24.11 | v81.08,35.95 v84.65,33.99 | v79.41,34.11 79.16,34.78 78.39,35.45 74.37,37.87 69.02,42.7 67.36,42.7 64.4,39.84 61.91,39.11 U$1.14_B1 | 95.25,24.11 95.26,23.35 95.27,22.63 U$15.1
B1_M_DIV  (via drill 0.6)
  Top 0.203: v99.14,19.46 99.14,18.66 R36.2 | v101.09,13.66 95.55,11.13 95.55,10.33 JP6.5
  Bottom 0.203: v101.09,13.66 101.25,18.13 99.93,19.47 v99.14,19.47 v99.14,19.46
B1_M_IN  (via drill 0.6)
  Top 0.203: R35.1 95.94,18.16 96.84,18.16 R36.1 97.44,17.66 97.44,16.76 99.74,16.76 101.58,17.76 101.59,25.73 99.15,25.83 R32.2 98.45,26.33 98.45,28.53 94.25,28.53 v93.56,27.81
  Bottom 0.203: v93.56,27.81 93.35,26.28 U$15.4
B1_P_DIV
  Top 0.203: R33.2 93.34,20.56 92.44,20.56 92.45,12.53 94.45,10.53 94.45,8.63 94.75,8.33 94.95,8.33 94.95,7.53 JP6.3
B1_P_M  (via drill 0.6)
  Top 0.203: R33.1 95.94,20.76 96.74,20.76 R34.1 97.04,20.36 v97.04,19.56
  Bottom 0.203: U$15.3 93.35,22.63 93.35,21.13 96.25,21.13 97.05,20.33 v97.05,19.55 v97.04,19.56
B5
  Top 0.203: IC1.11 72.68,43.47 69.71,56.24 50.8,56.17 50.81,25.19 50.81,25.17 U$1.28_B5
B5BUF  (via drill 0.6)
  Top 0.203: U$25.2 124.12,13.6 124.24,14.79 124.25,14.8 124.24,17.52 v123.48,18.65 v123.48,18.66 v123.49,18.66 124.09,19.31 124.69,20.59 JP14.3 | 85.4,43.48 v85.16,43.48 81.8,43.48 IC1.4 | JP1.12 91.21,43.47 91.22,41.19 92.19,40.5 94.19,40.48 95.56,40.2 96.72,39.88 104.93,38.9 110.23,31.59 110.33,30.08 v111.9,29.13
  Top 0.406: JP14.4 124.72,22.92 124.69,20.59
  Bottom 0.203: v85.16,43.48 88.8,43.68 89.15,43.86 89.43,44.36 JP1.12 | v111.9,29.13 114.38,27.2 116.93,23.48 117.01,18.45 121.05,18.31 121.67,18.24 122.85,18.31 v123.49,18.66 v123.48,18.66
B6
  Top 0.203: U$1.27_B6 44.27,22.04 44.2,56.68 70.17,56.7 72.48,47.26 73.13,45.98 74.74,45.98 IC1.9
B6BUFF  (via drill 0.6)
  Top 0.203: 85.4,46.08 v85.13,46.14 81.69,46.08 81.69,46.07 | 81.69,46.07 IC1.6 | 81.69,46.07 81.8,46.08 | v30.93,52.59 38.55,53.38 39.37,57.75 41.02,57.98 42.06,58.81 71.57,58.72 v72.33,58.39
  Bottom 0.203: v85.13,46.14 88.9,46.18 88.9,46.68 89.5,46.68 JP1.10 89.91,47.24 91.01,48.48 95.84,48.43 97.35,48.57 Q18.1 | v85.13,46.14 84.9,46.38 | DRV2.3 v30.93,52.59 | v72.33,58.39 72.49,58.53 82.16,59.11 82.7,47.41 85.56,46.08 v85.13,46.14
B7
  Top 0.203: 73.8,51.98 IC2.13 74.28,51.98 72.88,51.99 70.5,57.17 43.64,57.21 43.69,19.41 U$1.26_B7
B7BUF  (via drill 0.6)
  Top 0.203: v84.4,51.98 81.8,51.98 IC2.2 | JP1.6 89.89,52.24 90.62,51.05 93.23,51.2 94.32,51.83 96.82,53.21 Q20.1 100.01,53.68 101.83,53.66 v106.3,53.62 | U$24.2 124.68,49.73 124.68,52.76 125.18,53.52 | JP13.3 125.07,55.58 125.18,53.52 | 125.18,53.52 125.18,53.54 | v125.18,53.49 125.18,53.52
  Top 0.406: 125.06,58.24 JP13.4
  Top 1.016: JP13.3 125.06,58.24
  Bottom 0.203: v84.4,51.98 85.1,51.28 88.9,51.28 88.9,51.68 89.6,51.68 JP1.6 | v106.3,53.62 v125.18,53.49
B8
  Top 0.203: U$1.25_B8 43.13,16.69 43.15,57.73 70.9,57.7 73,54.42 74.45,54.43 IC2.11
B8BUF  (via drill 0.6)
  Top 0.203: v85.17,53.75 84.9,54.38 84.9,54.48 IC2.4 | U$26.2 109.95,14.53 109.95,17.61 108.11,18.29 107.9,20.33 JP15.3 | v101.78,36.67 102.9,33.25 104.47,33.21 104.62,31.83 107.52,31.62 107.54,30 108.74,29.12 109.74,26.53 109.37,25.02 108.15,22.81 JP15.4
  Top 0.406: JP15.4 107.97,22.88 107.9,20.33
  Bottom 0.203: 89,53.78 v85.17,53.75 | 89,53.78 89,54.38 89.4,54.38 JP1.4 | 89,53.78 91,56.15 93.96,56.15 94.92,53.6 99.4,52.3 101.44,49.63 v101.78,36.67
B9
  Top 0.203: IC2.9 72.54,57 71.1,58.21 42.59,58.19 42.59,14.78 46.57,13.85 U$1.24_B9
B9BUF
  Top 0.203: IC2.6 81.8,56.98 84.9,56.98 84.9,58.08 85.8,58.98 89.9,58.98 89.9,58.08 JP1.2 | U$23.2 110.46,49.99 110.5,52.8 109.28,53.77 JP10.3
  Top 0.406: JP10.3 109.32,55.54 JP10.4
  Bottom 0.203: JP1.2 91.15,58.91 93.43,58.91 96.33,56.5 98.48,54.89 100.82,54.86 102.08,55.83 103.18,56.53 104.43,56.55 104.99,56.68 108.5,56.76 109.31,55.57 JP10.3
B10  (via drill 0.6)
  Top 0.203: v49.37,53.16 v49.48,42.06
  Bottom 0.203: v49.48,42.06 U$1.15_B10 | v49.37,53.16 49.39,56.37 44.5,56.21 42.25,53.79 41.28,53.45 39.24,53.75 37.5,53.79 DRV1.3
B10DRV
  Bottom 0.203: R25.1 32.82,55.67 34.64,55.67 DRV1.5
B10DRVOUT
  Bottom 0.203: JP2.1 30.91,57.49 31.96,57.97 R25.2
B12
  Bottom 0.203: DRV3.3 39.09,49.74 40.65,51.74 44.43,53.02 46.59,54.44 U$1.40_B12
B12DRV
  Bottom 0.203: R47.1 28.11,51.73 32.02,51.62 34.83,51.72 DRV3.5
B12DRVOUT
  Bottom 0.203: JP9.1 19.06,45.98 R47.2
B13  (via drill 0.6)
  Top 0.203: 41.53,59.82 94.84,59.75 98.37,55.21 v102.23,54.62 | v101.82,51.69 101.92,50.21 100.65,48.16 98.48,47.9 98.49,46.56 Q17.1 | v41.16,49.71 v41.34,54.97 | 41.53,59.82 41.51,59.82 | v40.81,59.29 41.53,59.82
  Bottom 0.203: U$1.39_B13 46.63,51.84 v41.16,49.71 | v102.23,54.62 v101.82,51.69 | v41.34,54.97 41.2,56.72 v40.81,59.29
BF6
  Bottom 0.4: JP12.3 95.11,47.19 Q18.3
BF7
  Top 0.203: 100.42,52.26 Q20.3
  Top 0.4: JP12.4 100.04,49.79 100.42,50.44 100.42,52.26
BIA_MIDPT_IN
  Bottom 0.203: R20.2 51.08,7.48 R19.1 52.4,7.55 52.91,9.22 55.96,9.22 55.91,7.64 U$3.3
BIAS_MIDPT_OUT  (via drill 0.6)
  Top 0.203: v72.2,11.55 72.23,11.55 | v72.29,19.21 72.33,19.25
  Top 0.406: v72.23,4.2 v72.2,11.55 | 72.23,11.55 v72.29,19.21 | 72.33,19.25 v72.39,26.56
  Bottom 0.203: U$3.1 54.46,6.35 55.52,6.29 U$3.4 | 70.6,5.16 R37.1 70.6,4.87 | v72.2,11.55 R38.2 | v72.29,19.21 R23.1 | v72.39,26.56 R39.1
  Bottom 0.406: U$3.4 55.97,3.34 70.22,3.34 70.6,5.16 | 70.6,4.87 v72.23,4.2
C14
  Top 0.203: IC1.13 72.64,40.91 69.3,55.65 51.41,55.66 51.64,18.16 55.24,17.61 56.31,16.7 56.95,15.7 59.13,12.44 U$1.3_C14
C14BUF  (via drill 0.6)
  Top 0.203: v83.82,40.96 81.8,40.98 IC1.2
  Bottom 0.203: 85.4,40.48 85.4,37.48 85.6,37.28 86.6,37.28 Q8.1 | 85.4,40.48 90,40.48 90,41.48 JP1.14 89.87,42.04 90.96,43.45 97.46,43.4 Q12.1 | v83.82,40.96 85.3,40.48 85.4,40.48
C15  (via drill 0.6)
  Top 0.203: v58.49,16.44 59.69,13.75 61.79,13.84 U$1.4_C15
  Bottom 0.203: U$18.1 48.42,22.66 55.08,20.25 v58.49,16.44
CAN_RAW_PLUS  (via drill 0.6)
  Top 0.203: 12.7,1.25 12.7,10.14 | v20.12,30.2 19.1,30.28 18.9,30.29
  Bottom 0.203: v20.12,30.2 44.96,30.3 51.34,30.07 56.4,32.14 R12.2
  pour Top: 18.13,32.27 18.92,30.52 18.78,28.48 18.44,27.37 14.17,27.33 12.42,26.92 12.42,20.6 18.25,17.88 18.23,10.93 14.45,9.67 2.19,10.74 2.15,30.12 1.91,36.42 2.46,38.27 3.97,38.6 5.1,38.43 5.17,35.25 10.07,35.29 13.27,34.27 17.44,33.91
CANCABLE_1_1
  Bottom 0.406: P11.MP 16.95,32.34 JP8.1
CANCABLE_1_8
  Bottom 0.406: P18.MP 14.91,19.75 JP8.8
CANCABLE_2_1
  Bottom 0.406: P21.MP 16.95,15.58 JP7.1
CANCABLE_2_8
  Bottom 0.406: P28.MP 14.12,2.95 JP7.8
CANRX  (via drill 0.6)
  Top 0.203: v38.91,36.54 38.91,25.9 36.26,19.71 v36.17,19.63
  Bottom 0.203: IC103.4 35.64,20.19 v36.17,19.63 | v38.91,36.54 U$1.33_A11_CANRX
CANTX  (via drill 0.6)
  Top 0.203: v40.95,26.03 v40.98,34.03
  Bottom 0.203: 35.34,24.24 35.32,24.3 35.03,24.24 | IC103.1 35.03,24.24 | v40.98,34.03 U$1.32_A12_CANTX | v40.95,26.03 36.68,24.27 35.05,24.14 35.03,24.24
CF14
  Bottom 0.4: Q12.3 96.85,42.07 95.15,42.14 JP12.1
DIODE+
  Top 1.778: D2.C 6,51.58 3.07,51.54 U$11.MP
  Bottom 0.4: D2.C 7.6,51.57 7.58,51.57
  Bottom 1.27: 7.58,51.57 2.15,51.55
DIV1  (via drill 0.6)
  Top 0.203: v98.11,14.88 v105.51,14.76
  Bottom 0.203: R18.2 77.35,5.24 R44.1 77.08,5.26 78.99,5.44 81.18,10.08 86.84,13.55 89.16,15.31 | U$2.15 86.25,17.24 88.49,17.24 89.09,16.54 89.16,15.31 | JP14.7 129.87,20.56 129.79,19.02 129.37,18.14 129.73,16.72 129.28,15.14 128.03,14.49 U$25.4 126.78,13.62 126.15,9.87 108.18,9.86 106.57,10.87 105.9,14.07 v105.51,14.76 | 89.16,15.31 v98.11,14.88
  Bottom 0.406: JP14.8 129.81,22.96 129.87,20.56
DIV2  (via drill 0.6)
  Top 0.203: U$24.4 127.11,52.65 130.19,55.65 JP13.7 | v89.79,19.76 89.97,26.91 90.74,30.94 99.98,30.87 100.43,30.39 101.34,30.39 v102.07,31.32
  Top 0.406: JP13.7 130.17,55.61
  Top 1.016: 130.17,55.61 JP13.8
  Bottom 0.203: R10.2 77.01,12.73 R43.1 78.48,12.73 79.92,13.5 82.06,13.99 83.41,14.47 83.73,15.1 83.74,16.65 U$2.16 86.56,19.72 v89.79,19.76 | v102.07,31.32 102.51,33.3 104.45,33.22 104.76,34.21 105.63,34.8 106.9,35.11 125.33,35.86 127.2,48.76 U$24.4
DIV3
  Bottom 0.203: R16.2 76.76,20.03 R42.1 76.86,20.06 78.01,20.13 79.91,19.57 83.94,19.74 U$2.17
DIV4
  Bottom 0.203: R8.2 76.59,27.53 R41.1 76.63,27.51 78.46,27.45 78.59,27.44 80.65,24.77 83.68,24.75 U$2.18
DIV5  (via drill 0.6)
  Top 0.203: U$2.19 86.27,27.44 89,27.39 90.33,31.42 92.11,31.4 99.73,31.46 v100.78,31.59 | JP15.8 113.06,22.77 113.01,24.51 112.86,25.24 v112.36,25.97
  Top 0.406: JP15.8 JP15.7
  Bottom 0.203: R14.2 69.55,40.63 70.57,38.67 70.61,37.9 R45.1 73.25,37.94 77.94,34.69 78.62,33.49 79.29,32.85 80.72,31.28 81.48,29.93 83.22,29.87 83.76,29.29 83.82,27.88 84.7,26.93 U$2.19 | v100.78,31.59 101.01,29.09 104.38,29.09 105.25,29.57 106.54,29.91 107.73,29.67 108.53,29.26 109.6,27.41 v112.36,25.97 | U$26.4 113.66,14.36 114.54,14.62 114.93,14.97 115.31,15.97 115.6,16.73 115.52,17.44 115.07,17.92 114.26,18.78 113.04,20.1 JP15.7
DIV6  (via drill 0.6)
  Top 0.203: v87.09,34.57 87.42,34.39 90.16,34.56 v92.19,33.45 | JP10.7 113,52.47 112.96,49.26 112.9,48.57 U$23.4
  Top 0.406: JP10.7 114.4,55.54
  Top 1.016: 114.4,55.54 JP10.8
  Bottom 0.203: U$2.20 84.92,29.24 83.78,30.26 83.74,31.7 | 83.74,31.7 79.72,35.21 74.62,38.47 71.05,43.66 69.38,44.61 R46.1 69.41,44.61 R6.2 | 83.74,31.7 84.76,32.8 86.09,33 v87.09,34.57 | v92.19,33.45 93.64,32.93 98.33,32.8 100.52,32.98 101.51,33.71 102.53,35.15 104.3,35.2 105.06,36.46 112.19,42.66 112.96,48.75 U$23.4
FET-D
  Top 0.4: 2.92,56.7 D2.A
  Top 1.27: D2.A 10.13,56.78 11.29,55.95 U$21.3 12.75,54.11 12.78,50.56 U$9.2
  Top 1.778: U$10.MP 2.92,56.7
  Bottom 1.27: U$10.MP 2.12,56.74 2.29,56.75
GND  (via drill 0.6, 0.6 pad 0.25, 1)
  Top 0.203: v11.9,40.1 R2.1 | 98.65,29.53 99.35,28.83 99.35,27.13
  Top 0.406: 106.75,58.14 JP10.2 JP10.1
  Bottom 0.203: 15.77,23.86 16.07,23.86 | 15.77,23.86 15.67,23.86 | 15.77,23.86 15.61,23.9 | 18.07,24.16 17.08,24.76 16.02,24.66 15.17,24.26 13.97,24.26 13.37,23.66 13.32,23.61 | 13.32,23.61 13.24,23.53 | 11.57,23.76 11.56,23.63 11.57,23.56 11.57,23.49 | 13.32,23.61 13.27,23.66 13.22,23.48 | v11.9,40.1 11.87,40.07 | 74.79,40.49 71.69,43.59 | 81.5,40.28 84.4,37.38 84.9,37.38 84.9,37.18 85.1,37.18 85.1,36.98 85.3,36.98 85.3,36.88 85.4,36.88 85.4,36.78 86.1,36.78 | 100.58,26.56 99.85,27.1 99.35,27.13 99.74,28.1 99.52,28.68 | 97.53,28.75 97.53,30.45 | 98.75,16.13 98.85,16.13 98.85,17.53 98.89,17.68 | U$15.2 94.32,21.62 96.55,21.61
  other vias: 100.72,27.59 24.32,5.87 111.28,33.62 106.12,33.58 117.43,37.19 35.94,17.47 35.99,15.39 36.02,13.52 35.99,11.56 36.08,9.6 36.08,7.59 39.12,7.59 39.06,9.6 39.99,5.38 21.83,7.86 25.61,2.93 26.77,19.05 25.04,19.01 23.38,19.01 23.43,22.7 24.95,22.64 26.58,22.97 88.49,3.74 86.51,3.38 102.28,9.12 100.01,9.46 94.05,14.03 96.96,13.34 83.61,50.71 84.2,48.17 83.66,53.37 83.28,55.68 103.47,59.39 52.69,4.78 21.47,17.26 21.44,25.99 83,39.72 52.84,53.56 52.89,51.48 52.92,49.61 52.89,47.65 52.98,45.69 52.98,43.68 73.45,48.98 76.21,48.91 52.87,40.55 52.88,38.42 52.84,36.32 52.91,34.14 52.93,32.18 53.05,29.13 53.1,27.11 53.17,24.97 53.13,19.37 49.82,20.63 78.83,25.43 52.12,16.91 65.64,50.48 74.07,35.73 79.71,21.15 76.64,16.49 76.54,23.85 39.45,52.34 40.32,56.71 32.11,48.4 24.9,49.21 20.92,53.66 20.75,58.38 100.6,20.45 92.19,21.73 91.11,11.84 88.92,13.67 89.83,17.72 103.49,11.72 99.32,3.26 43.4,12.73 78.55,28.69 79.68,30.86 68.77,31.93 68.84,25.34 68.74,17.94 68.74,10.85 67.16,34.42 136.49,13.43 134.03,11.6 103.48,58.41 103.52,57.43 103.52,55.64 103.51,54.57 103.51,52.77 103.53,51.8 103.53,50.83 103.52,49.9 103.52,48.89 103.55,47.91 103.56,46.9 103.52,45.94 103.52,44.93 103.5,43.94 103.5,42.96 103.48,41.94 103.49,40.89 103.49,39.93 103.49,38.16 103.51,37.13 103.51,35.99 103.51,34.08 103.51,29.92 103.49,28.21 103.52,27.2 103.52,26.19 103.5,25.19 103.51,24.21 103.51,23.25 103.55,22.24 103.55,21.17 103.55,20.06 103.52,19.02 103.51,17.96 103.54,16.9 103.54,15.78 103.54,13.95 103.5,12.83 103.5,10.72 103.47,9.68 103.55,8.62 103.53,7.56 103.53,6.52 103.49,5.51 103.52,4.53 103.51,3.45 103.53,2.36 104.54,30.77 105.55,30.74 106.59,30.72 108.36,30.76 109.39,30.73 111.13,30.8 112.23,30.81 117.94,30.78 118.93,30.74 119.92,30.78 126.55,30.84 127.58,30.79 128.59,30.79 129.63,30.79 130.67,30.79 131.72,30.81 132.75,30.81 133.77,30.8 134.77,30.8 135.77,30.79 103.49,32.3 103.5,31.14 135.16,36.98 134.84,51.26 58.78,4.91 58.68,7.34 65.13,5.02 52.62,13.42 57.29,12.29 53.21,22.91
  pour Bottom: 0.01,-0.01 0.01,61.84 138.31,61.85 138.32,0.01
  pour Top (rank 4): 0.06,61.79 138.32,61.85 138.31,0.01 0.02,0
LED_BUS_PWR
  Top 0.203: R2.2 15.57,40.16 | LED2.C 17.12,40.05 16.47,40.16
  Top 0.61: 15.57,40.16 16.47,40.16
MCP2551_CANH
  Top 0.203: JP7.4 16.91,9.8
  Top 0.4: 16.91,9.8 19.05,10.14 19.05,11.41 19.04,11.8
  Top 0.406: 19.04,11.8 19,12.76 19.07,17.88 15,17.88 12.56,19.94 12.76,26.67 JP8.4
  Bottom 0.203: 18.69,26.15 18.9,25.71 19.05,25.38 19.05,22.84 19.74,21.49 22.28,21.49 22.32,21.5 26.92,21.5 26.92,21.6 27.02,21.6 28.02,22.6 IC103.7
  Bottom 0.406: JP8.4 18.69,26.15
MCP2551_CANL  (via drill 0.6, 0.7)
  Top 0.203: 14.27,8.68 13.99,8.62 | 14.27,8.68 18.65,8.44 | 19.71,24.49 20.11,24.37 v20.13,23.86 | JP8.5 14.36,25.46 14.36,25.48 | 14.27,8.68 13.97,8.87 JP7.5 | 19.9,20.3 v21.22,20.34
  Top 0.254: 19.15,8.49 19.19,8.47 | 14.27,8.68 14.18,8.63
  Top 0.4: 19.9,20.29 19.9,20.3
  Top 0.406: v20.13,23.86 19.75,22.69 19.9,20.29 19.91,18.97 19.98,11.61 20.03,10.51 19.84,8.86 19.19,8.47 | 14.34,25.48 14.36,25.48 14.91,25.54 15.93,25.48 17.27,25.41 18.57,25.16 19.71,24.49 20.12,23.83 | 14.27,8.68 19.15,8.49
  Bottom 0.203: v21.22,20.34 27.02,20.3 27.02,20.4 27.12,20.4 28.02,21.3 IC103.6
N$2
  Bottom 0.203: U$18.3 39.69,21.75 39.67,20.07 40.66,18.2 JP11.1
N$5
  Top 0.4: 95.13,44.71 JP12.2 95.06,44.81 97.13,43.59 100.87,43.52 100.87,44.71 Q17.3
N$29
  Top 0.4: R26.2 18.45,54.75 18.46,53.56 U$21.1
  Bottom 0.203: 19.95,56.27 R26.2
  Bottom 0.4: U$9.1 19.95,56.27
N$38
  Top 0.203: D1.A 93.08,37.5 95.54,37.28 96.81,36 97.06,35.23 JP16.2
  Bottom 0.203: Q8.3 89.4,38.18 89.4,39.28 91.5,39.28 D1.A
N$39
  Bottom 0.203: JP16.1 94.49,35.34 D1.C
N$41
  Bottom 0.203: R26.1 23.23,54.52 24.73,54.49 DRV2.5
NB5
  Top 0.203: IC1.3 79.9,42.18 79.1,42.18 78.5,42.78 78.5,44.78 75.7,44.78 IC1.10
NB6
  Top 0.203: IC1.5 79.9,44.78 79.1,44.78 79,44.88 79,47.28 75.7,47.28 IC1.8
NB7
  Top 0.203: IC2.1 79.9,50.68 79.2,50.68 78.19,51.25 78.19,52.66 77.31,53.19 75.6,53.18 IC2.12
NB8
  Top 0.203: IC2.3 79.9,53.18 79.2,53.18 78.45,53.76 78.44,55.12 77.88,55.74 75.6,55.78 IC2.10
NB9
  Top 0.203: IC2.5 79.9,55.78 79.2,55.78 78.85,55.95 78.84,57.55 78.13,58.28 75.6,58.28 IC2.8
NC14
  Top 0.203: IC1.1 79.1,39.68 78.5,40.28 78.5,42.18 75.7,42.18 IC1.12
PA9_USART1_TX
  Bottom 0.203: U$1.35_A9_UTX 41.46,42.63 29.48,43.21 28.71,45.28 JP3.5
PA10_USART1_RX  (via drill 0.6)
  Top 0.203: v41.3,39.13 41.36,43.11 32.53,43.3 31.16,45.12 JP3.4
  Bottom 0.203: v41.3,39.13 U$1.34_A10_URX

### Text on the board
tNames: + | G | D | G
bNames: GND | GND | 3V3 | DIV2 | R | B9BUF | B7BUF | B11 | +12V | B10 | DIV6 | TX | RX | GND | +12V | B1 | CAN RAW + | A7 | 12V | 5V | CAN RAW + | A6 | A5 | A4 | TX | CANH | A3 | A2 | RX | A1 | CANL | A0 | f103Ard | 5V | B8BUF | B5BUF | DIV1 | 180707 | DIV5 | GND | REV 1 | GND | 3V3 | 5V | 5V | 5V
bStop: f103Ard | 07/01/2018